# Altium schematic sheet MainBoard_TinyK20_RF.SchDoc: Main Board MCU and nRF24L01+
size A4; DrawnBy: M. Schwegler; Organization: HSLU T&A; Address1: Abteilung Elektrotechnik; Address2: Technikumsstrasse 21; Address3: CH-6048 Horw; Revision: v1; SheetNumber: 2; SheetTotal: 5; Projektname: SmartBoard; DocumentName: MainBoard; ProjectName: SmartBoard
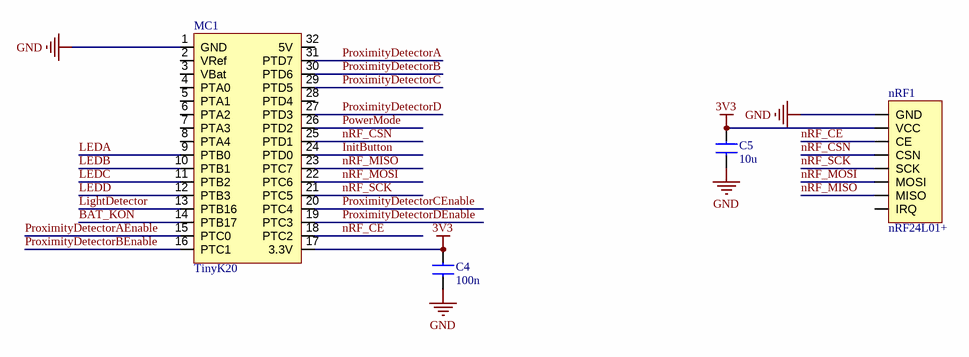
[diagram p0: MainBoard_TinyK20_RF.SchDoc]

## Parts
C4  100n  [0805_C]
C5  10u  [0805_C]
MC1  TinyK20  [DIP32]
nRF1  nRF24L01+  [CON_THT_2x4P_RM2.54_Stiftl]

## Nets
3V3: C4.2 C5.2 MC1.17(3.3V) nRF1.2(VCC)
GND: C4.1 C5.1 MC1.1(GND) nRF1.1(GND)
BAT_KON: MC1.14(PTB17)
InitButton: MC1.24(PTD0)
LEDA: MC1.9(PTB0)
LEDB: MC1.10(PTB1)
LEDC: MC1.11(PTB2)
LEDD: MC1.12(PTB3)
LightDetector: MC1.13(PTB16)
nRF_CE: MC1.18(PTC2) nRF1.3(CE)
nRF_CSN: MC1.25(PTD1) nRF1.4(CSN)
nRF_MISO: MC1.23(PTC7) nRF1.7(MISO)
nRF_MOSI: MC1.22(PTC6) nRF1.6(MOSI)
nRF_SCK: MC1.21(PTC5) nRF1.5(SCK)
PowerMode: MC1.26(PTD2)
ProximityDetectorA: MC1.31(PTD7)
ProximityDetectorAEnable: MC1.15(PTC0)
ProximityDetectorB: MC1.30(PTD6)
ProximityDetectorBEnable: MC1.16(PTC1)
ProximityDetectorC: MC1.29(PTD5)
ProximityDetectorCEnable: MC1.20(PTC4)
ProximityDetectorD: MC1.27(PTD3)
ProximityDetectorDEnable: MC1.19(PTC3)

Not connected (* = marked no-connect by the designer): MC1 2(VRef) 3(VBat) 4(PTA0) 5(PTA1) 6(PTA2) 7(PTA3) 8(PTA4) 28(PTD4) 32(5V); nRF1 8(IRQ)

## Notes on the sheet
- Project:
- Drawn by:
- Size:
- Sheet
- A4
- Rev.:
- of
- Date:
- File:

## Library data of the parts
C4 C5 = C?: Normaler Kondensator
nRF1 = Bluefruit